# Altium project BMS_AFE.PrjPcb (part 1 of 3)
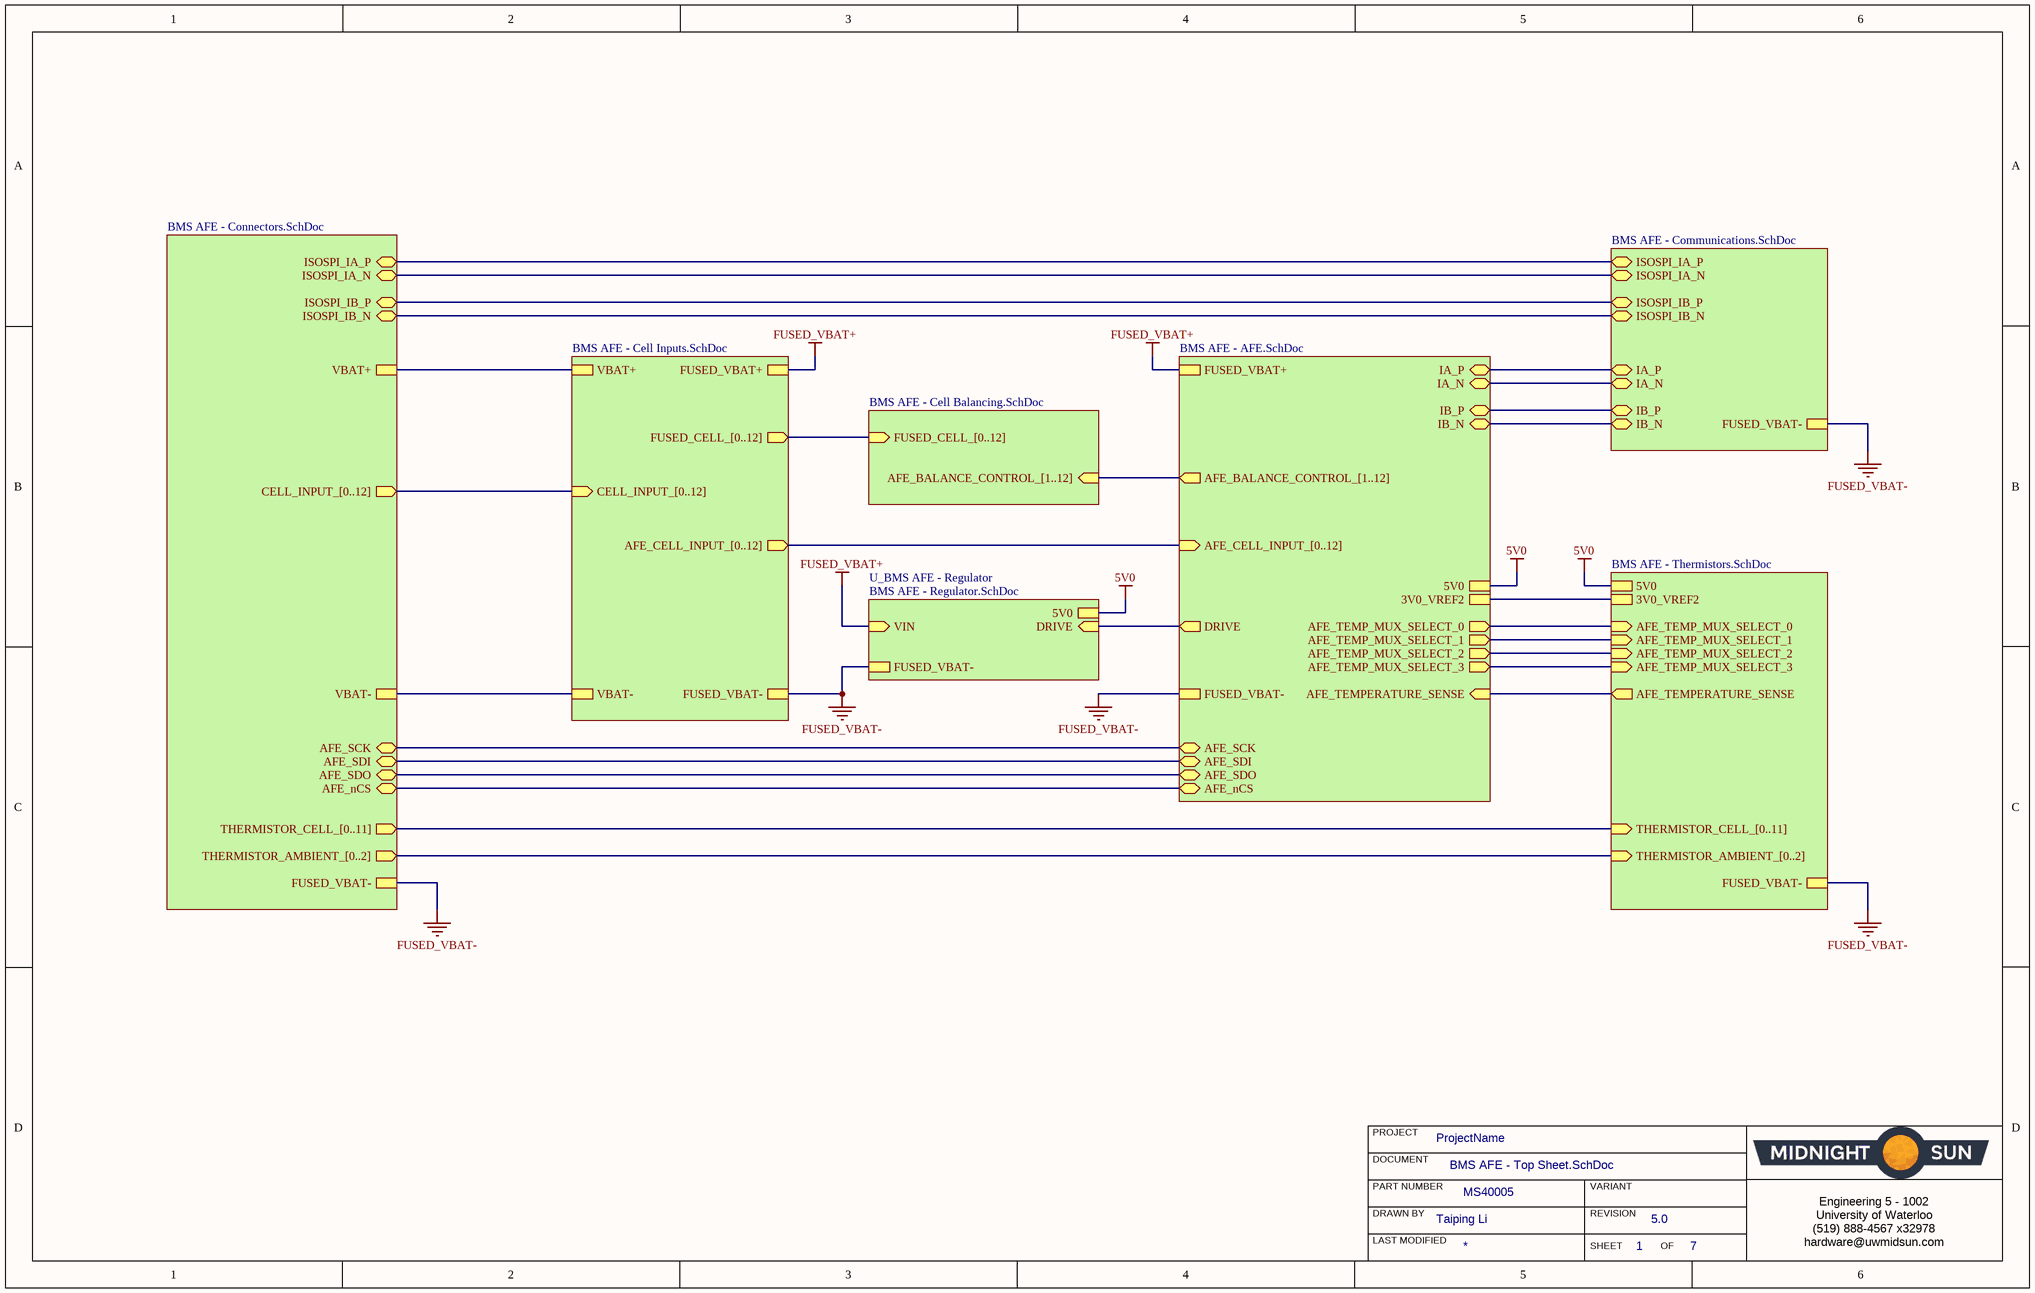
[diagram p0: BMS AFE - Top Sheet.SchDoc]
ProjectRevision: 5.0; ProjectAuthor: Taiping Li; MSPartNumber: MS40005
8 sheets, 185 parts. Net scope: strictly hierarchical (ports join the sheet entries above them; power ports are local).
Board file: AFE.PcbDoc
Sheets:
  BMS AFE - Top Sheet.SchDoc
    BMS AFE - AFE = BMS AFE - AFE.SchDoc
    BMS AFE - Cell Balancing = BMS AFE - Cell Balancing.SchDoc
    BMS AFE - Cell Inputs = BMS AFE - Cell Inputs.SchDoc
    BMS AFE - Communications = BMS AFE - Communications.SchDoc
    BMS AFE - Thermistors = BMS AFE - Thermistors.SchDoc
    BMS AFE - Connectors = BMS AFE - Connectors.SchDoc
    U_BMS AFE - Regulator = BMS AFE - Regulator.SchDoc

## Sheet BMS AFE - Top Sheet.SchDoc: Title
size B; Organization: Midnight Sun Solar Rayce Car Team; Address1: University of Waterloo; Address2: 200 University Ave W; Address3: Waterloo, ON, Canada; Address4: N2L 3E9; DocumentNumber: 1; SheetNumber: 1; SheetTotal: 7; Website: www.uwmidsun.com; ProjectName: ProjectName

### Sub-sheets
BMS AFE - AFE = BMS AFE - AFE.SchDoc: AFE_BALANCE_CONTROL_[1..12] (out), AFE_TEMP_MUX_SELECT_0 (out), AFE_TEMP_MUX_SELECT_3 (out), AFE_nCS (bidir), AFE_SCK (bidir), AFE_TEMP_MUX_SELECT_2 (out), 5V0, FUSED_VBAT-, 3V0_VREF2, AFE_CELL_INPUT_[0..12] (in), AFE_TEMPERATURE_SENSE (in), AFE_TEMP_MUX_SELECT_1 (out), FUSED_VBAT+, AFE_SDI (bidir), AFE_SDO (bidir), IA_N (bidir), IA_P (bidir), IB_N (bidir), IB_P (bidir), DRIVE (out)
BMS AFE - Cell Balancing = BMS AFE - Cell Balancing.SchDoc: FUSED_CELL_[0..12] (in), AFE_BALANCE_CONTROL_[1..12] (in)
BMS AFE - Cell Inputs = BMS AFE - Cell Inputs.SchDoc: VBAT+, FUSED_VBAT+, CELL_INPUT_[0..12] (in), AFE_CELL_INPUT_[0..12] (out), FUSED_VBAT-, FUSED_CELL_[0..12] (out), VBAT-
BMS AFE - Communications = BMS AFE - Communications.SchDoc: IB_P (bidir), IB_N (bidir), ISOSPI_IA_P (bidir), ISOSPI_IA_N (bidir), IA_P (bidir), ISOSPI_IB_P (bidir), IA_N (bidir), ISOSPI_IB_N (bidir), FUSED_VBAT-
BMS AFE - Connectors = BMS AFE - Connectors.SchDoc: ISOSPI_IB_N (bidir), ISOSPI_IB_P (bidir), ISOSPI_IA_N (bidir), ISOSPI_IA_P (bidir), VBAT+, VBAT-, AFE_nCS (bidir), AFE_SCK (bidir), CELL_INPUT_[0..12] (out), THERMISTOR_CELL_[0..11] (out), AFE_SDI (bidir), AFE_SDO (bidir), FUSED_VBAT-, THERMISTOR_AMBIENT_[0..2] (out)
BMS AFE - Thermistors = BMS AFE - Thermistors.SchDoc: AFE_TEMPERATURE_SENSE (out), THERMISTOR_AMBIENT_[0..2] (in), 5V0, 3V0_VREF2, AFE_TEMP_MUX_SELECT_3 (in), AFE_TEMP_MUX_SELECT_2 (in), AFE_TEMP_MUX_SELECT_1 (in), AFE_TEMP_MUX_SELECT_0 (in), THERMISTOR_CELL_[0..11] (in), FUSED_VBAT-
U_BMS AFE - Regulator = BMS AFE - Regulator.SchDoc: DRIVE (in), VIN (in), 5V0, FUSED_VBAT-

### Nets
3V0_VREF2: sheet BMS AFE - AFE/3V0_VREF2, sheet BMS AFE - Thermistors/3V0_VREF2
5V0: sheet BMS AFE - AFE/5V0, sheet BMS AFE - Thermistors/5V0, sheet U_BMS AFE - Regulator/5V0
FUSED_VBAT+: sheet BMS AFE - AFE/FUSED_VBAT+, sheet BMS AFE - Cell Inputs/FUSED_VBAT+, sheet U_BMS AFE - Regulator/VIN
FUSED_VBAT-: sheet BMS AFE - AFE/FUSED_VBAT-, sheet BMS AFE - Cell Inputs/FUSED_VBAT-, sheet BMS AFE - Communications/FUSED_VBAT-, sheet BMS AFE - Thermistors/FUSED_VBAT-, sheet BMS AFE - Connectors/FUSED_VBAT-, sheet U_BMS AFE - Regulator/FUSED_VBAT-
AFE_TEMP_MUX_SELECT_0: sheet BMS AFE - AFE/AFE_TEMP_MUX_SELECT_0, sheet BMS AFE - Thermistors/AFE_TEMP_MUX_SELECT_0
AFE_TEMP_MUX_SELECT_1: sheet BMS AFE - AFE/AFE_TEMP_MUX_SELECT_1, sheet BMS AFE - Thermistors/AFE_TEMP_MUX_SELECT_1
AFE_TEMP_MUX_SELECT_2: sheet BMS AFE - AFE/AFE_TEMP_MUX_SELECT_2, sheet BMS AFE - Thermistors/AFE_TEMP_MUX_SELECT_2
AFE_TEMP_MUX_SELECT_3: sheet BMS AFE - AFE/AFE_TEMP_MUX_SELECT_3, sheet BMS AFE - Thermistors/AFE_TEMP_MUX_SELECT_3
IA_N: sheet BMS AFE - AFE/IA_N, sheet BMS AFE - Communications/IA_N
IA_P: sheet BMS AFE - AFE/IA_P, sheet BMS AFE - Communications/IA_P
IB_N: sheet BMS AFE - AFE/IB_N, sheet BMS AFE - Communications/IB_N
IB_P: sheet BMS AFE - AFE/IB_P, sheet BMS AFE - Communications/IB_P
ISOSPI_IA_N: sheet BMS AFE - Communications/ISOSPI_IA_N, sheet BMS AFE - Connectors/ISOSPI_IA_N
ISOSPI_IA_P: sheet BMS AFE - Communications/ISOSPI_IA_P, sheet BMS AFE - Connectors/ISOSPI_IA_P
ISOSPI_IB_N: sheet BMS AFE - Communications/ISOSPI_IB_N, sheet BMS AFE - Connectors/ISOSPI_IB_N
ISOSPI_IB_P: sheet BMS AFE - Communications/ISOSPI_IB_P, sheet BMS AFE - Connectors/ISOSPI_IB_P
NetC42_1: sheet BMS AFE - AFE/AFE_TEMPERATURE_SENSE, sheet BMS AFE - Thermistors/AFE_TEMPERATURE_SENSE
NetF1_1: sheet BMS AFE - Cell Inputs/VBAT-, sheet BMS AFE - Connectors/VBAT-
NetF2_1: sheet BMS AFE - Cell Inputs/VBAT+, sheet BMS AFE - Connectors/VBAT+
NetP7_1: sheet BMS AFE - AFE/AFE_SCK, sheet BMS AFE - Connectors/AFE_SCK
NetP7_2: sheet BMS AFE - AFE/AFE_SDI, sheet BMS AFE - Connectors/AFE_SDI
NetP7_3: sheet BMS AFE - AFE/AFE_SDO, sheet BMS AFE - Connectors/AFE_SDO
NetP7_4: sheet BMS AFE - AFE/AFE_nCS, sheet BMS AFE - Connectors/AFE_nCS
NetR71_1: sheet BMS AFE - AFE/DRIVE, sheet U_BMS AFE - Regulator/DRIVE

### Buses and harness runs
bus sheet BMS AFE - AFE/AFE_BALANCE_CONTROL_[1..12] = sheet BMS AFE - Cell Balancing/AFE_BALANCE_CONTROL_[1..12]
bus sheet BMS AFE - AFE/AFE_CELL_INPUT_[0..12] = sheet BMS AFE - Cell Inputs/AFE_CELL_INPUT_[0..12]
bus sheet BMS AFE - Cell Balancing/FUSED_CELL_[0..12] = sheet BMS AFE - Cell Inputs/FUSED_CELL_[0..12]
bus sheet BMS AFE - Cell Inputs/CELL_INPUT_[0..12] = sheet BMS AFE - Connectors/CELL_INPUT_[0..12]
bus sheet BMS AFE - Connectors/THERMISTOR_AMBIENT_[0..2] = sheet BMS AFE - Thermistors/THERMISTOR_AMBIENT_[0..2]
bus sheet BMS AFE - Connectors/THERMISTOR_CELL_[0..11] = sheet BMS AFE - Thermistors/THERMISTOR_CELL_[0..11]

### Notes on the sheet
- PROJECT
- DOCUMENT
- DRAWN BY
- LAST MODIFIED
- PART NUMBER
- REVISION
- SHEET
- VARIANT
- OF
- Engineering 5 - 1002
  University of Waterloo
  (519) 888-4567 x32978
  hardware@uwmidsun.com

## Sheet BMS AFE - AFE.SchDoc: Title
size B; Organization: Midnight Sun Solar Rayce Car Team; Address1: University of Waterloo; Address2: 200 University Ave W; Address3: Waterloo, ON, Canada; Address4: N2L 3E9; DocumentNumber: 5; SheetNumber: 5; SheetTotal: 7; Website: www.uwmidsun.com; ProjectName: ProjectName
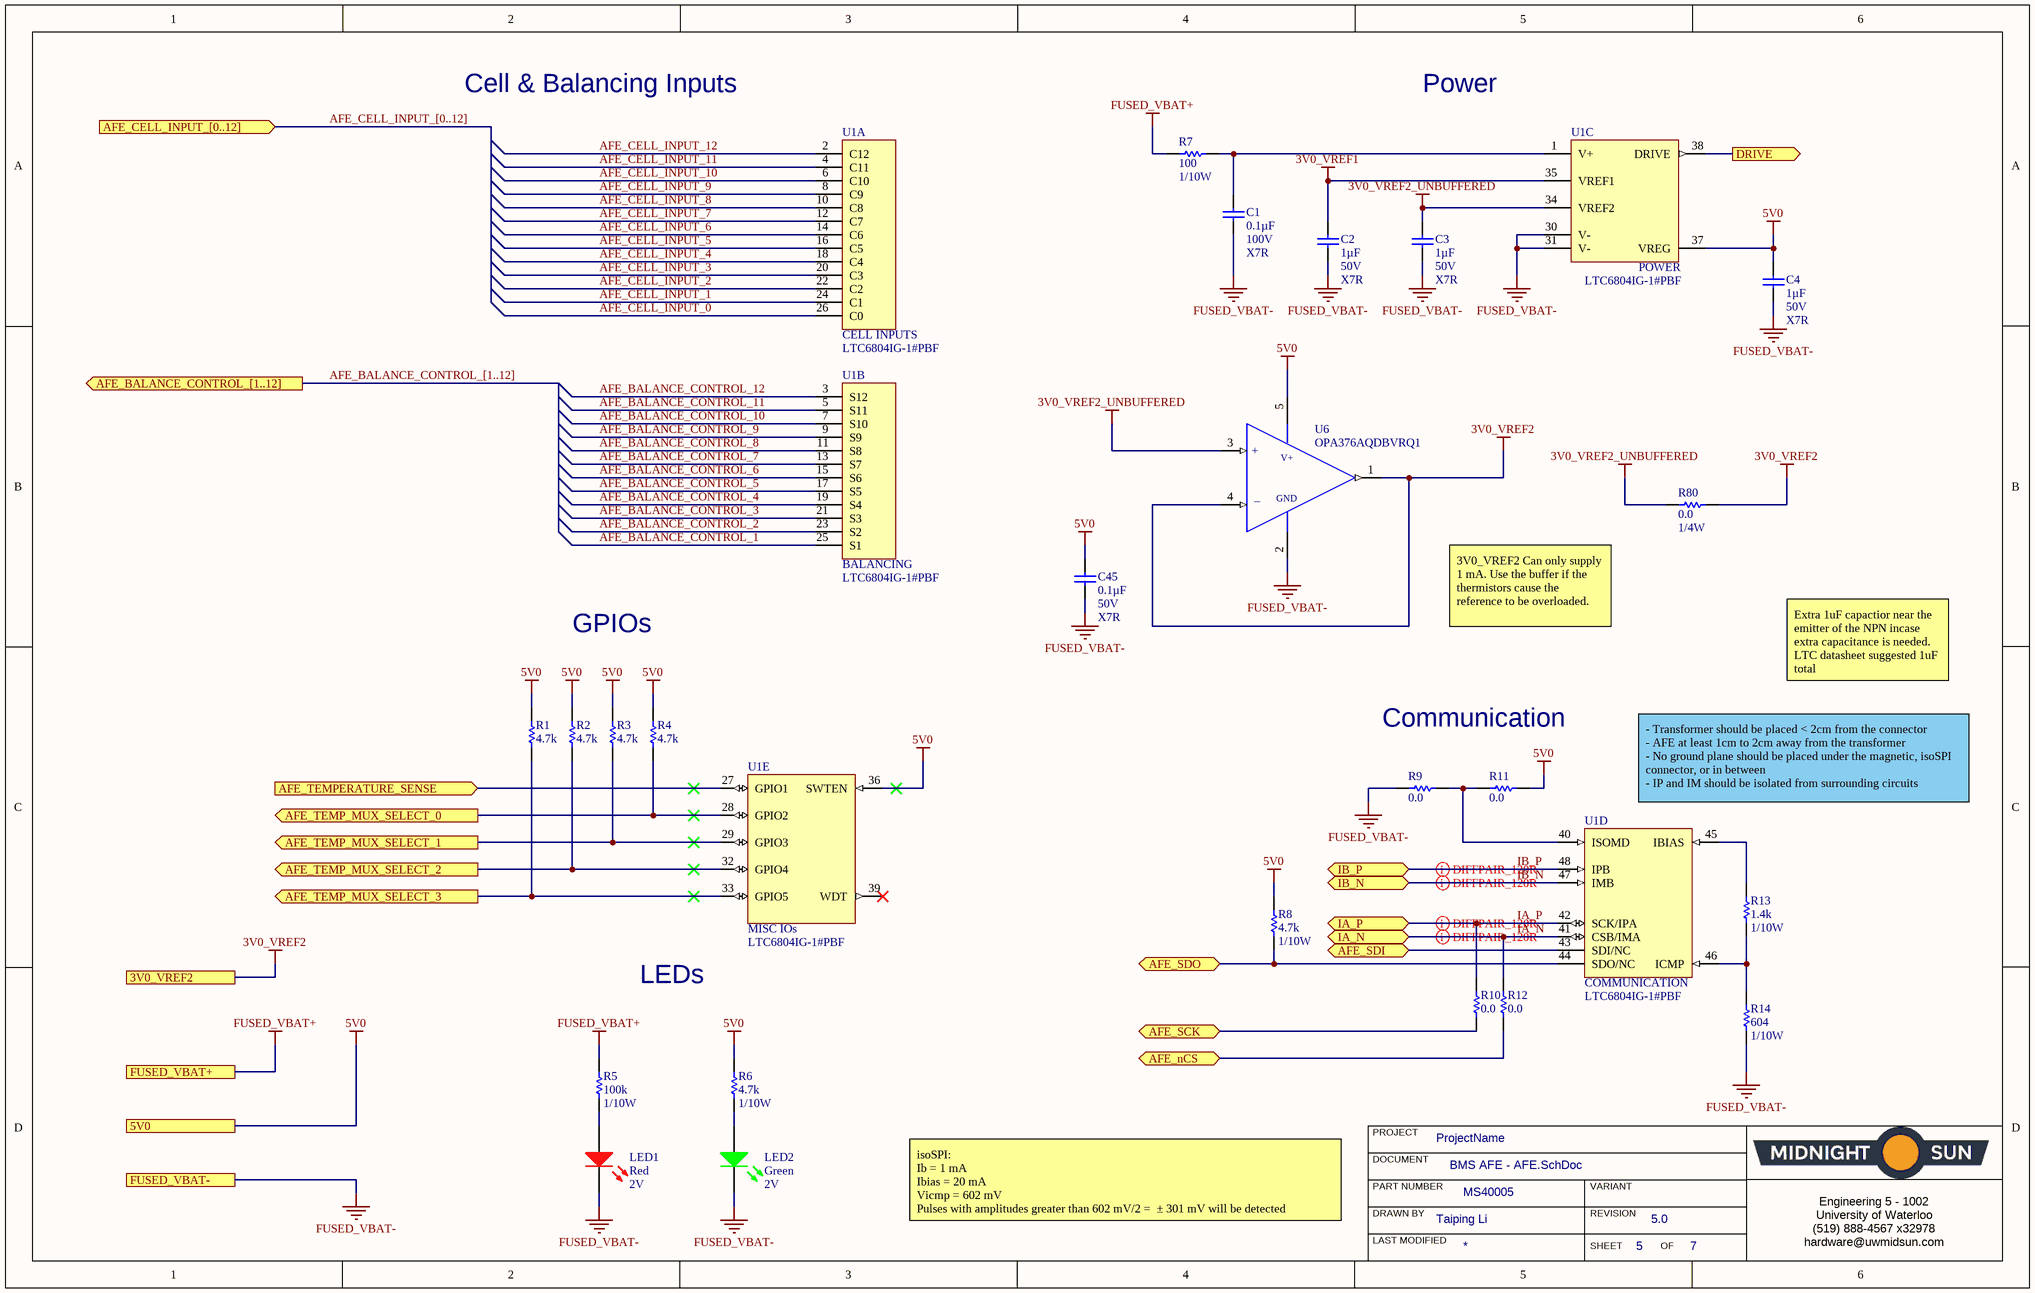
[diagram p1: BMS AFE - AFE.SchDoc]

### Parts
C1  Capacitance: 0.1µF  Voltage: 100V  Temperature Coefficient: X7R  [CAP, 0805]  (hidden comment: CAP CER 0.1UF 100V 10% X7R 0805)
C2  Capacitance: 1µF  Voltage: 50V  Temperature Coefficient: X7R  [CAP, 0603]  (hidden comment: CAP CER 1UF 50V 10% X7R 0603)
C3  Capacitance: 1µF  Voltage: 50V  Temperature Coefficient: X7R  [CAP, 0603]  (hidden comment: CAP CER 1UF 50V 10% X7R 0603)
C4  Capacitance: 1µF  Voltage: 50V  Temperature Coefficient: X7R  [CAP, 0603]  (hidden comment: CAP CER 1UF 50V 10% X7R 0603)
C45  Capacitance: 0.1µF  Voltage: 50V  Temperature Coefficient: X7R  [CAP, 0603]  (hidden comment: CAP CER 0.1UF 50V 10% X7R 0603)
LED1  Color: Red  Voltage - Forward (Vf) (Typ): 2V  [LED_0603]  (hidden comment: LED RED CLEAR 2V 0603)
LED2  Color: Green  Voltage - Forward (Vf) (Typ): 2V  [LED_0603]  (hidden comment: LED GREEN CLEAR 2V 0603)
R1  Resistance (Ohms): 4.7k  [RES, 0603]  (hidden comment: RES 4.7K OHM 1% 1/10W 0603)
R2  Resistance (Ohms): 4.7k  [RES, 0603]  (hidden comment: RES 4.7K OHM 1% 1/10W 0603)
R3  Resistance (Ohms): 4.7k  [RES, 0603]  (hidden comment: RES 4.7K OHM 1% 1/10W 0603)
R4  Resistance (Ohms): 4.7k  [RES, 0603]  (hidden comment: RES 4.7K OHM 1% 1/10W 0603)
R5  Resistance: 100k  Power: 1/10W  [RES, 0603]  (hidden comment: RES 100K OHM 5% 1/8W 0603)
R6  Resistance (Ohms): 4.7k  Power (Watts): 1/10W  [RES, 0603]  (hidden comment: RES 4.7K OHM 1% 1/10W 0603)
R7  Resistance: 100  Power: 1/10W  [RES, 0603]  (hidden comment: RES 100 OHM 1% 1/10W 0603)
R8  Resistance (Ohms): 4.7k  Power (Watts): 1/10W  [RES, 0603]  (hidden comment: RES 4.7K OHM 1% 1/10W 0603)
R9  Resistance: 0.0  [RES, 0603]  (hidden comment: RES 0.0 OHM 1/4W 0603)
R10  Resistance: 0.0  [RES, 0603]  (hidden comment: RES 0.0 OHM 1/4W 0603)
R11  Resistance: 0.0  [RES, 0603]  (hidden comment: RES 0.0 OHM 1/4W 0603)
R12  Resistance: 0.0  [RES, 0603]  (hidden comment: RES 0.0 OHM 1/4W 0603)
R13  Resistance: 1.4k  Power: 1/10W  [RES, 0603]  (hidden comment: RES 1.4k OHM 1% 1/10W 0603)
R14  Resistance: 604  Power: 1/10W  [RES, 0603]  (hidden comment: RES 604 OHM 1% 1/10W 0603)
R80  Resistance: 0.0  Power (Watts): 1/4W  [RES, 0603]  (hidden comment: RES 0.0 OHM 1/4W 0603)
U1  Manufacturer Part Number 1: LTC6804IG-1#PBF  [SSOP50P780X200-48N]  (hidden comment: IC MONITOR BATT STACK 48SSOP)  (parts A,B,C,D,E of 5)
U6  Manufacturer Part Number: OPA376AQDBVRQ1  [IC OP AMP GP RR 10MHZ SOT-23-5]  (hidden comment: IC OP AMP GEN PURPOSE RR 5.5MHZ SOT-23-5)

### Ports
3V0_VREF2, 5V0, AFE_BALANCE_CONTROL_[1..12] (out), AFE_CELL_INPUT_[0..12] (in), AFE_nCS (bidir), AFE_SCK (bidir), AFE_SDI (bidir), AFE_SDO (bidir), AFE_TEMP_MUX_SELECT_0 (out), AFE_TEMP_MUX_SELECT_1 (out), AFE_TEMP_MUX_SELECT_2 (out), AFE_TEMP_MUX_SELECT_3 (out), AFE_TEMPERATURE_SENSE (in), DRIVE (out), FUSED_VBAT+, FUSED_VBAT-, IA_N (bidir), IA_P (bidir), IB_N (bidir), IB_P (bidir)

### Nets
3V0_VREF1: C2.1 U1.35(VREF1)
3V0_VREF2: R80.2 U6.1(OUTPUT) U6.4(-IN) ; port 3V0_VREF2
3V0_VREF2_UNBUFFERED: C3.1 R80.1 U1.34(VREF2) U6.3(+IN)
5V0: C4.1 C45.1 R1.2 R2.2 R3.2 R4.2 R6.1 R8.1 R11.2 U1.36(SWTEN) U1.37(VREG) U6.5(VDD) ; port 5V0
FUSED_VBAT+: R5.1 R7.1 ; port FUSED_VBAT+
FUSED_VBAT-: C1.2 C2.2 C3.2 C4.2 C45.2 LED1.2(K) LED2.2(K) R9.1 R14.2 U1.30(V-) U1.31(V-) U6.2(VSS) ; port FUSED_VBAT-
AFE_BALANCE_CONTROL_1: U1.25(S1)
AFE_BALANCE_CONTROL_2: U1.23(S2)
AFE_BALANCE_CONTROL_3: U1.21(S3)
AFE_BALANCE_CONTROL_4: U1.19(S4)
AFE_BALANCE_CONTROL_5: U1.17(S5)
AFE_BALANCE_CONTROL_6: U1.15(S6)
AFE_BALANCE_CONTROL_7: U1.13(S7)
AFE_BALANCE_CONTROL_8: U1.11(S8)
AFE_BALANCE_CONTROL_9: U1.9(S9)
AFE_BALANCE_CONTROL_10: U1.7(S10)
AFE_BALANCE_CONTROL_11: U1.5(S11)
AFE_BALANCE_CONTROL_12: U1.3(S12)
AFE_CELL_INPUT_0: U1.26(C0)
AFE_CELL_INPUT_1: U1.24(C1)
AFE_CELL_INPUT_2: U1.22(C2)
AFE_CELL_INPUT_3: U1.20(C3)
AFE_CELL_INPUT_4: U1.18(C4)
AFE_CELL_INPUT_5: U1.16(C5)
AFE_CELL_INPUT_6: U1.14(C6)
AFE_CELL_INPUT_7: U1.12(C7)
AFE_CELL_INPUT_8: U1.10(C8)
AFE_CELL_INPUT_9: U1.8(C9)
AFE_CELL_INPUT_10: U1.6(C10)
AFE_CELL_INPUT_11: U1.4(C11)
AFE_CELL_INPUT_12: U1.2(C12)
AFE_TEMP_MUX_SELECT_0: R4.1 U1.28(GPIO2) ; port AFE_TEMP_MUX_SELECT_0
AFE_TEMP_MUX_SELECT_1: R3.1 U1.29(GPIO3) ; port AFE_TEMP_MUX_SELECT_1
AFE_TEMP_MUX_SELECT_2: R2.1 U1.32(GPIO4) ; port AFE_TEMP_MUX_SELECT_2
AFE_TEMP_MUX_SELECT_3: R1.1 U1.33(GPIO5) ; port AFE_TEMP_MUX_SELECT_3
IA_N: R12.1 U1.41(CSB/IMA) ; port IA_N
IA_P: R10.1 U1.42(SCK/IPA) ; port IA_P
IB_N: U1.47(IMB) ; port IB_N
IB_P: U1.48(IPB) ; port IB_P
NetC1_1: C1.1 R7.2 U1.1(V+)
NetC42_1: U1.27(GPIO1) ; port AFE_TEMPERATURE_SENSE
NetLED1_1: LED1.1(A) R5.2
NetLED2_1: LED2.1(A) R6.2
NetP7_1: R10.2 ; port AFE_SCK
NetP7_2: U1.43(SDI/NC) ; port AFE_SDI
NetP7_3: R8.2 U1.44(SDO/NC) ; port AFE_SDO
NetP7_4: R12.2 ; port AFE_nCS
NetR9_2: R9.2 R11.1 U1.40(ISOMD)
NetR13_1: R13.1 U1.45(IBIAS)
NetR13_2: R13.2 R14.1 U1.46(ICMP)
NetR71_1: U1.38(DRIVE) ; port DRIVE

Not connected (* = marked no-connect by the designer): U1 39(WDT)*

### Buses and harness runs
bus AFE_BALANCE_CONTROL_[1..12] = port AFE_BALANCE_CONTROL_[1..12]
bus AFE_CELL_INPUT_[0..12] = port AFE_CELL_INPUT_[0..12]

### Layout directives
differential pair: IA_N, IA_P, IB_N, IB_P

### Notes on the sheet
- Cell & Balancing Inputs
- Power
- GPIOs
- 3V0_VREF2 Can only supply  1 mA. Use the buffer if the thermistors cause the reference to be overloaded.
- Extra 1uF capactior near the emitter of the NPN incase extra capacitance is needed. LTC datasheet suggested 1uF total
- Communication
- (near U1) - Transformer should be placed < 2cm from the connector
  - AFE at least 1cm to 2cm away from the transformer
  - No ground plane should be placed under the magnetic, isoSPI connector, or in between
  - IP and IM should be isolated from surrounding circuits
- LEDs
- isoSPI:
  Ib = 1 mA
  Ibias = 20 mA
  Vicmp = 602 mV
  Pulses with amplitudes greater than 602 mV/2 =  ± 301 mV will be detected
- PROJECT
- DOCUMENT
- DRAWN BY
- LAST MODIFIED
- PART NUMBER
- REVISION
- SHEET
- VARIANT
- OF
- Engineering 5 - 1002
  University of Waterloo
  (519) 888-4567 x32978
  hardware@uwmidsun.com
- (in symbol IC MONITOR BATT STACK 48SSOP, part A) CELL INPUTS
- (in symbol IC MONITOR BATT STACK 48SSOP, part B) BALANCING
- (in symbol IC MONITOR BATT STACK 48SSOP, part C) POWER
- (in symbol IC MONITOR BATT STACK 48SSOP, part D) COMMUNICATION
- (in symbol IC MONITOR BATT STACK 48SSOP, part E) MISC IOs
- (in symbol IC OP AMP GEN PURPOSE RR 5.5MHZ SOT-23-5) +; V+; GND; _

### Library data of the parts
C1 = CAP CER 0.1UF 100V 10% X7R 0805: 0.1µF ±10% 100V Ceramic Capacitor X7R 0805 (2012 Metric); Manufacturer 1: Murata Electronics North America; Manufacturer Part Number 1: GCM21BR72A104KA37L; Supplier 1: Digi-Key; Supplier Part Number 1: 490-4789-1-ND; Packaging: Cut Tape (CT); Part Status: Active; Operating Temperature: -55°C ~ 125°C; Ratings: AEC-Q200; Mounting Type: Surface Mount, MLCC; Package / Case: 0805 (2012 Metric); Size / Dimension: 0.079" L x 0.049" W (2.00mm x 1.25mm); Height - Seated (Max): -; Thickness (Max): 0.055" (1.40mm); Lead Spacing: -; Lead Style: -; ComponentLink1URL: http://www.murata.com/~/media/webrenewal/support/library/catalog/products/capacitor/mlcc/c03e.ashx; ComponentLink1Description: http://www.murata.com/~/media/webrenewal/support/library/catalog/products/capacitor/mlcc/c03e.ashx; Tolerance: ±10%
C2-C4 = CAP CER 1UF 50V 10% X7R 0603: 1µF ±10% 50V Ceramic Capacitor X7R 0603 (1608 Metric); Manufacturer 1: Taiyo Yuden; Manufacturer Part Number 1: UMK107AB7105KA-T; Supplier 1: Digi-Key; Supplier Part Number 1: 587-3247-1-ND; Packaging: Cut Tape (CT); Part Status: Active; Operating Temperature: -55°C ~ 125°C; Ratings: -; Mounting Type: Surface Mount, MLCC; Package / Case: 0603 (1608 Metric); Size / Dimension: 0.063" L x 0.031" W (1.60mm x 0.80mm); Height - Seated (Max): -; Thickness (Max): 0.037" (0.95mm); Lead Spacing: -; Lead Style: -; ComponentLink1URL: http://www.yuden.co.jp/productdata/catalog/en/mlcc_all_e.pdf; ComponentLink1Description: http://www.yuden.co.jp/productdata/catalog/en/mlcc_all_e.pdf; Tolerance: ±10%
C45 = CAP CER 0.1UF 50V 10% X7R 0603: 0.10µF ±10% 50V Ceramic Capacitor X7R 0603 (1608 Metric); Manufacturer 1: AVX Corporation; Manufacturer Part Number 1: 06035C104KAT2A; Supplier 1: Digi-Key; Supplier Part Number 1: 478-5052-1-ND; Packaging: Cut Tape (CT); Part Status: Active; Operating Temperature: -55°C ~ 125°C; Ratings: -; Mounting Type: Surface Mount, MLCC; Package / Case: 0603 (1608 Metric); Size / Dimension: 0.063" L x 0.032" W (1.60mm x 0.81mm); Height - Seated (Max): -; Thickness (Max): 0.035" (0.90mm); Lead Spacing: -; Lead Style: -; ComponentLink1URL: http://datasheets.avx.com/X7RDielectric.pdf; ComponentLink1Description: http://datasheets.avx.com/X7RDielectric.pdf; Tolerance: ±10%
LED1 = LED RED CLEAR 2V 0603: Red 631nm LED Indication - Discrete 2V 0603 (1608 Metric); Manufacturer: Wurth Electronics Inc.; Manufacturer Part Number: 150060RS75000; Lens Color: Colorless; Millicandela Rating: 250mcd; Lens Style/Size: Rectangle with Flat Top, 1.10mm x 0.70mm; Current - Test: 20mA; Viewing Angle: 140°; Wavelength - Dominant: 625nm; Wavelength - Peak: 630nm; Supplier 1: Digi-Key; RoHS: RoHS Compliant; Category: Optoelectronics; Stock 1: 35521; Pricing 1: 1=0.21, 100=0.1617, 500=0.13964 (CAD); Packaging: Cut Tape (CT); Part Status: Active; Lens Transparency: Clear; Mounting Type: Surface Mount; Features: -; Package / Case: 0603 (1608 Metric); Supplier Device Package: 0603; Size / Dimension: 1.60mm L x 0.80mm W; Height (Max): 0.80mm; ComponentLink1URL: http://katalog.we-online.de/led/datasheet/150060RS75000.pdf; ComponentLink1Description: http://katalog.we-online.de/led/datasheet/150060RS75000.pdf; Supplier Part Number 1: 732-4978-1-ND
LED2 = LED GREEN CLEAR 2V 0603: Green 572nm LED Indication - Discrete 2V 0603 (1608 Metric); Manufacturer: Wurth Electronics Inc.; Manufacturer Part Number: 150060VS75000; Lens Color: Colorless; Millicandela Rating: 40mcd; Lens Style/Size: Rectangle with Flat Top, 1.10mm x 0.70mm; Current - Test: 20mA; Viewing Angle: 140°; Wavelength - Dominant: 570nm; Supplier 1: Digi-Key; RoHS: RoHS Compliant; Category: Optoelectronics; Stock 1: 9408; Pricing 1: 1=0.21, 100=0.1617, 500=0.13964 (CAD); Packaging: Cut Tape (CT); Part Status: Active; Lens Transparency: Clear; Mounting Type: Surface Mount; Wavelength - Peak: 572nm; Features: -; Package / Case: 0603 (1608 Metric); Supplier Device Package: 0603; Size / Dimension: 1.60mm L x 0.80mm W; Height (Max): 0.80mm; ComponentLink1URL: http://katalog.we-online.de/led/datasheet/150060VS75000.pdf; ComponentLink1Description: http://katalog.we-online.de/led/datasheet/150060VS75000.pdf; Supplier Part Number 1: 732-4980-1-ND
R1-R4 R8 = RES 4.7K OHM 1% 1/10W 0603: 4.7k Ohm ±1% 0.1W, 1/10W Chip Resistor 0603 (1608 Metric) Moisture Resistant Thick Film; Manufacturer 1: Yageo; Manufacturer Part Number 1: RC0603FR-074K7L; Description 1: RES SMD 4.7K OHM 1% 1/10W 0603; Temperature Coefficient: ±100ppm/°C; Supplier 1: Digi-Key; Supplier Part Number 1: 311-4.70KHRCT-ND; RoHS: RoHS Compliant; Category: Resistors; Stock 1: 3487566; Pricing 1: 1=0.16, 10=0.022, 100=0.0089, 1000=0.00402, 2500=0.00349 (CAD); Packaging: Cut Tape (CT); Part Status: Active; Composition: Thick Film; Features: Moisture Resistant; Operating Temperature: -55°C ~ 155°C; Package / Case: 0603 (1608 Metric); Supplier Device Package: 0603; Size / Dimension: 0.063" L x 0.031" W (1.60mm x 0.80mm); Height - Seated (Max): 0.022" (0.55mm); Failure Rate: -; ComponentLink1URL: http://www.yageo.com/documents/recent/PYu-RC_Group_51_RoHS_L_7.pdf; ComponentLink1Description: http://www.yageo.com/documents/recent/PYu-RC_Group_51_RoHS_L_7.pdf; Tolerance: ±1%
  R1-R4: Power (Watts): 1/10W
R5 = RES 100K OHM 5% 1/8W 0603: RES SMD 100K OHM 5% 1/10W 0603; Manufacturer 1: Yageo; Manufacturer Part Number 1: RC0603JR-07100KL; Temperature Coefficient: ±100ppm/°C; Supplier 1: Digi-Key; Supplier Part Number 1: 311-100KGRCT-ND; Packaging: Cut Tape (CT); Part Status: Active; Composition: Thick Film; Operating Temperature: -55°C ~ 155°C; Package / Case: 0603 (1608 Metric); Supplier Device Package: 0603; Size / Dimension: 0.063" L x 0.031" W (1.60mm x 0.80mm); Height - Seated (Max): 0.022" (0.55mm); Failure Rate: -; ComponentLink1URL: http://www.yageo.com/documents/recent/PYu-RC_Group_51_RoHS_L_7.pdf; ComponentLink1Description: http://www.yageo.com/documents/recent/PYu-RC_Group_51_RoHS_L_7.pdf; Tolerance: ±5%
R6 = RES 4.7K OHM 1% 1/10W 0603: 4.7k Ohm ±1% 0.1W, 1/10W Chip Resistor 0603 (1608 Metric) Moisture Resistant Thick Film; Manufacturer 1: Yageo; Manufacturer Part Number 1: RC0603FR-074K7L; Temperature Coefficient: ±100ppm/°C; Description 1: RES SMD 4.7K OHM 1% 1/10W 0603; Supplier 1: Digi-Key; Supplier Part Number 1: 311-4.70KHRCT-ND; Packaging: Cut Tape (CT); Part Status: Active; Composition: Thick Film; Operating Temperature: -55°C ~ 155°C; Package / Case: 0603 (1608 Metric); Supplier Device Package: 0603; Size / Dimension: 0.063" L x 0.031" W (1.60mm x 0.80mm); Height - Seated (Max): 0.022" (0.55mm); Failure Rate: -; ComponentLink1URL: http://www.yageo.com/documents/recent/PYu-RC_Group_51_RoHS_L_7.pdf; ComponentLink1Description: http://www.yageo.com/documents/recent/PYu-RC_Group_51_RoHS_L_7.pdf; Tolerance: ±1%; RoHS: RoHS Compliant; Category: Resistors; Stock 1: 3487566; Pricing 1: 1=0.16, 10=0.022, 100=0.0089, 1000=0.00402, 2500=0.00349 (CAD); Features: Moisture Resistant
R7 = RES 100 OHM 1% 1/10W 0603: 100 Ohm ±1% 0.1W, 1/10W Chip Resistor 0603 (1608 Metric) Moisture Resistant Thick Film; Manufacturer 1: Yageo; Manufacturer Part Number 1: RC0603FR-07100RL; Temperature Coefficient: ±100ppm/°C; Supplier 1: Digi-Key; Supplier Part Number 1: 311-100HRCT-ND; Packaging: Cut Tape (CT); Part Status: Active; Composition: Thick Film; Operating Temperature: -55°C ~ 155°C; Package / Case: 0603 (1608 Metric); Supplier Device Package: 0603; Size / Dimension: 0.063" L x 0.031" W (1.60mm x 0.80mm); Height - Seated (Max): 0.022" (0.55mm); Failure Rate: -; ComponentLink1URL: http://www.yageo.com/documents/recent/PYu-RC_Group_51_RoHS_L_7.pdf; ComponentLink1Description: http://www.yageo.com/documents/recent/PYu-RC_Group_51_RoHS_L_7.pdf; Tolerance: ±1%
R9-R12 R80 = RES 0.0 OHM 1/4W 0603: RES SMD 0.0 OHM JUMPER 1/4W 0603; Manufacturer 1: Vishay Dale; Manufacturer Part Number 1: CRCW06030000Z0EAHP; Supplier 1: Digi-Key; Supplier Part Number 1: 541-0.0SBCT-ND; Packaging: Cut Tape (CT); Part Status: Active; Composition: Thick Film; Operating Temperature: -55°C ~ 155°C; Package / Case: 0603 (1608 Metric); Supplier Device Package: 0603; Size / Dimension: 0.063" L x 0.033" W (1.60mm x 0.85mm); Height - Seated (Max): 0.022" (0.55mm); Failure Rate: -; ComponentLink1URL: http://www.vishay.com/docs/20043/crcwhpe3.pdf; ComponentLink1Description: http://www.vishay.com/docs/20043/crcwhpe3.pdf
  R9-R12: Power (Watts): 1/4W
R13 = RES 1.4k OHM 1% 1/10W 0603: RES SMD 1.4K OHM 1% 1/10W 0603; Manufacturer 1: Yageo; Manufacturer Part Number 1: RC0603FR-071K4L; Temperature Coefficient: ±100ppm/°C; Supplier 1: Digi-Key; Supplier Part Number 1: 311-1.40KHRCT-ND; Packaging: Cut Tape (CT); Part Status: Active; Composition: Thick Film; Operating Temperature: -55°C ~ 155°C; Package / Case: 0603 (1608 Metric); Supplier Device Package: 0603; Size / Dimension: 0.063" L x 0.031" W (1.60mm x 0.80mm); Height - Seated (Max): 0.022" (0.55mm); Failure Rate: -; ComponentLink1URL: http://www.yageo.com/documents/recent/PYu-RC_Group_51_RoHS_L_7.pdf; ComponentLink1Description: http://www.yageo.com/documents/recent/PYu-RC_Group_51_RoHS_L_7.pdf; Tolerance: ±1%
R14 = RES 604 OHM 1% 1/10W 0603: RES SMD 604 OHM 1% 1/10W 0603; Manufacturer 1: Yageo; Manufacturer Part Number 1: RC0603FR-07604RL; Temperature Coefficient: ±100ppm/°C; Supplier 1: Digi-Key; Supplier Part Number 1: 311-604HRCT-ND; Packaging: Cut Tape (CT); Part Status: Active; Composition: Thick Film; Operating Temperature: -55°C ~ 155°C; Package / Case: 0603 (1608 Metric); Supplier Device Package: 0603; Size / Dimension: 0.063" L x 0.031" W (1.60mm x 0.80mm); Height - Seated (Max): 0.022" (0.55mm); Failure Rate: -; ComponentLink1URL: http://www.yageo.com/documents/recent/PYu-RC_Group_51_RoHS_L_7.pdf; ComponentLink1Description: http://www.yageo.com/documents/recent/PYu-RC_Group_51_RoHS_L_7.pdf; Tolerance: ±1%
U1 = IC MONITOR BATT STACK 48SSOP: Battery Battery Monitor IC Multi-Chemistry 48-SSOP; Manufacturer 1: Linear Technology; Number of Cells: 1 ~ 12; Fault Protection: Over/Under Voltage; Interface: I²C, SPI; Supplier 1: Digi-Key; Supplier Part Number 1: LTC6804IG-1#PBF-ND; Packaging: Tube; Part Status: Active; Function: Battery Monitor; Battery Chemistry: Multi-Chemistry; Operating Temperature: -40°C ~ 85°C (TA); Package / Case: 48-FSOP (0.209", 5.30mm Width); Supplier Device Package: 48-SSOP; ComponentLink1URL: http://www.linear.com/docs/43171; ComponentLink1Description: http://www.linear.com/docs/43171
U6 = IC OP AMP GEN PURPOSE RR 5.5MHZ SOT-23-5: General Purpose Amplifier 1 Circuit Rail-to-Rail SOT-23-5; Manufacturer: Texas Instruments; Max Supply Voltage: 5.5V; Min Supply Voltage: 2.2V; Output Current: 30mA; Nominal Supply Current: 950uA; Voltage Gain: 134dB; Common Mode Rejection Ratio: 76dB; Number of Channels: 1; Slew Rate: 2V/µs; Max I/O Voltage: 25uV; Input Bias Current: 10pA; Operating Supply Current: 760uA; Output Current per Channel: 50mA; Power Supply Rejection Ratio (PSRR): 106.02dB; Supplier 1: Digi-Key; Stock 1: 26635; Pricing 1: 1 = 2.14000, 10 = 1.92200, 100 = 1.54450, 500 = 1.26896, 1000 = 1.05142 (USD); RoHS: Yes; Case/Package: SOT-23-5; Number of Pins: 5; Min Operating Temperature: -40°C; Max Operating Temperature: 125°C; Unity Gain Bandwidth Product: 5.5MHz; Packaging: Tape and Reel; Package Quantity: 3000; Number of Circuits: 1; Gain Bandwidth Product: 5.5MHz; Input Offset Voltage (Vos): 25uV; Number of Elements: 1; Radiation Hardening: No; Lead Free: Lead Free; ComponentLink1URL: http://www.ti.com/lit/ds/sbos549/sbos549.pdf?src-supplier=Avnet; ComponentLink1Description: http://www.ti.com/lit/ds/sbos549/sbos549.pdf?src-supplier=Avnet; Supplier Part Number 1: 296-36701-1-ND

## Sheet BMS AFE - Cell Balancing.SchDoc: Title
size B; Organization: Midnight Sun Solar Rayce Car Team; Address1: University of Waterloo; Address2: 200 University Ave W; Address3: Waterloo, ON, Canada; Address4: N2L 3E9; DocumentNumber: 4; SheetNumber: 4; SheetTotal: 7; Website: www.uwmidsun.com; ProjectName: ProjectName
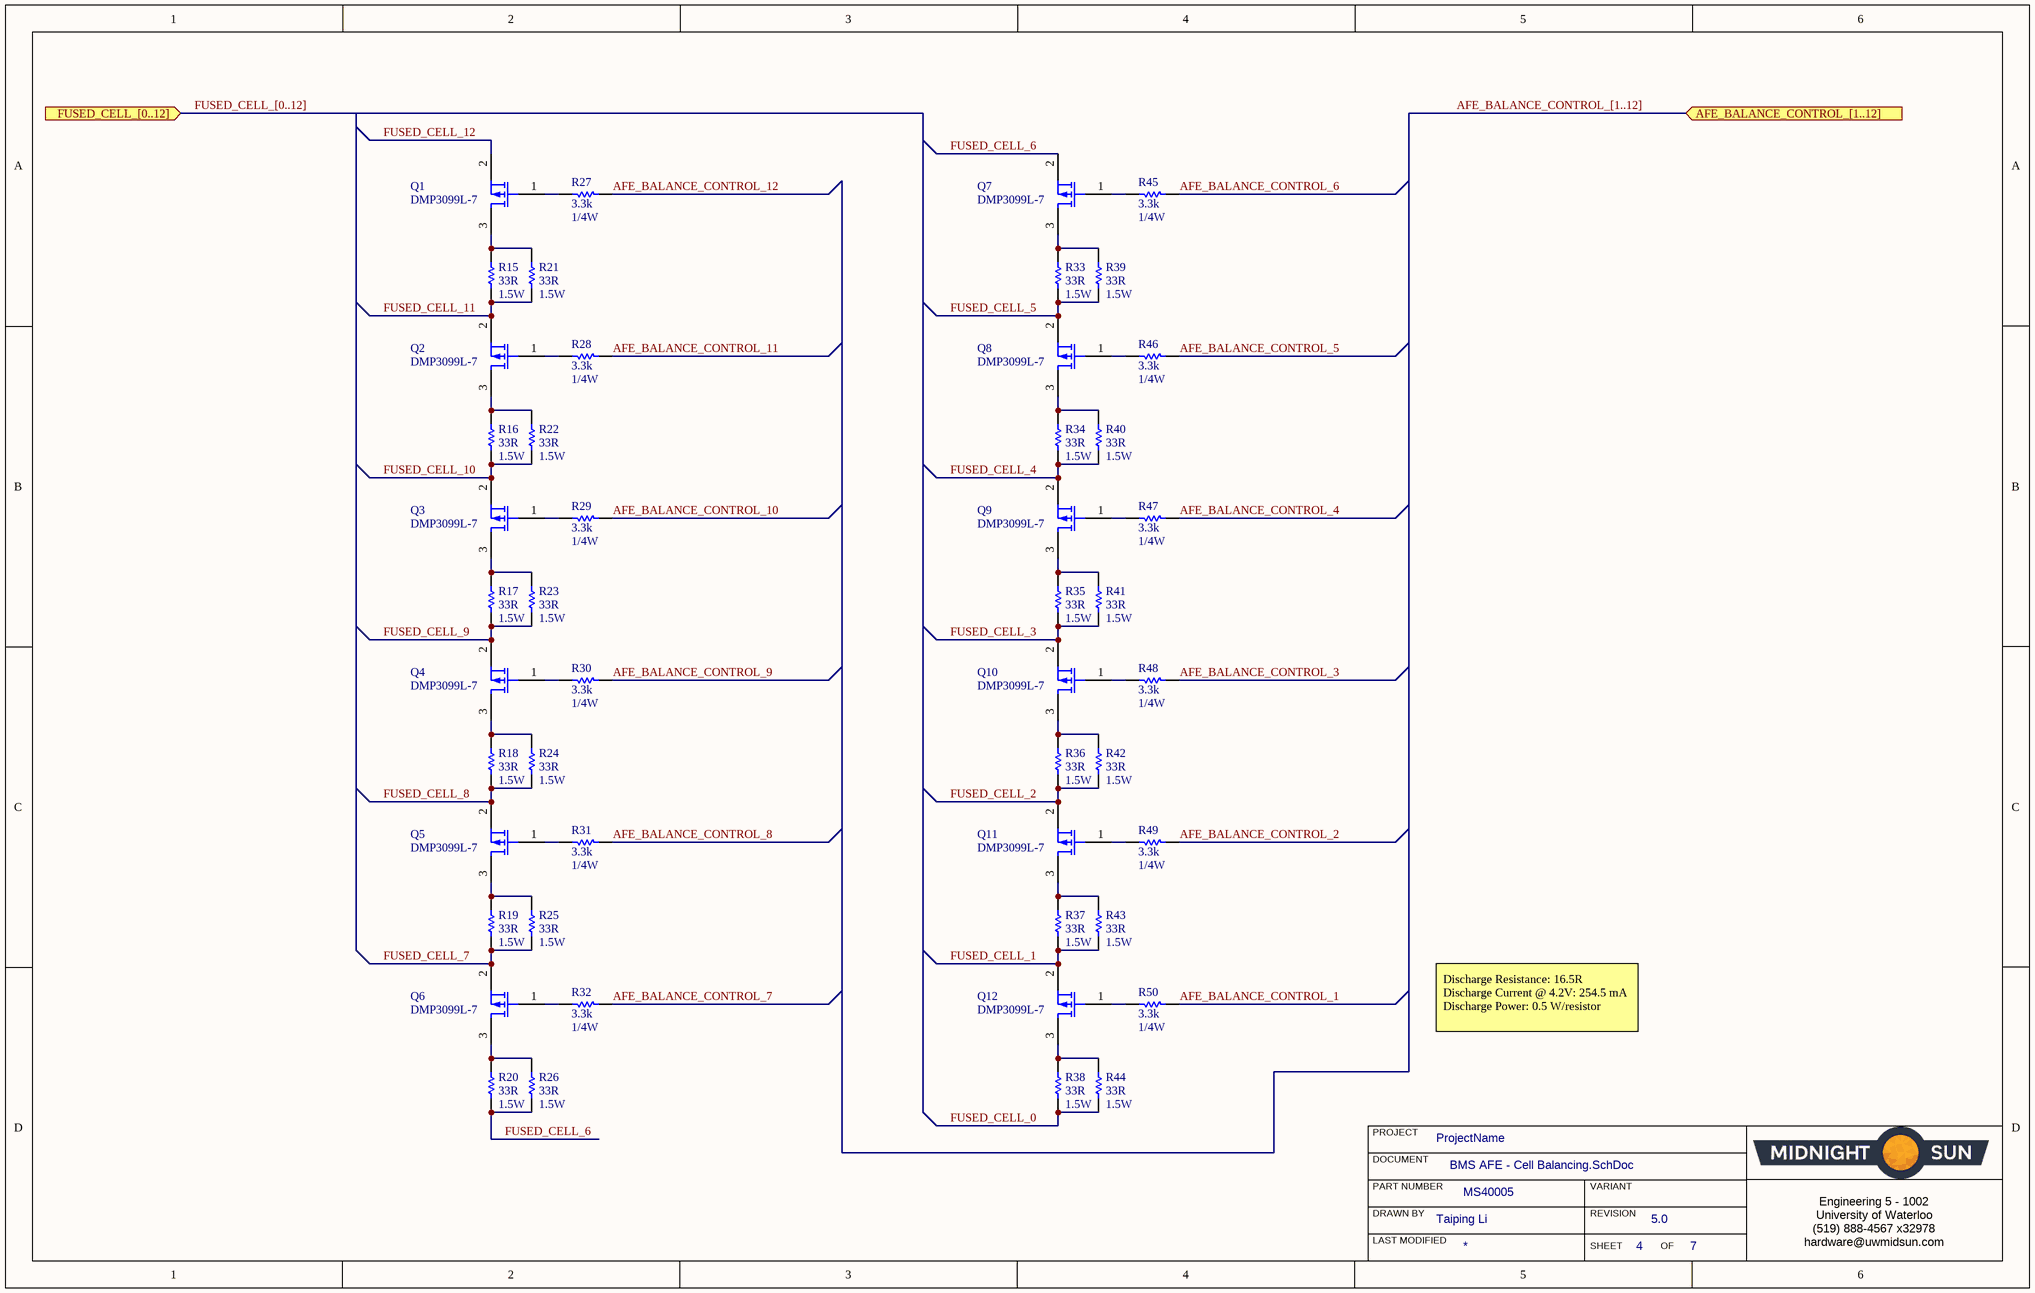
[diagram p2: BMS AFE - Cell Balancing.SchDoc]

### Parts
Q1  Manufacturer Part Number: DMP3099L-7  [MOSFET P-CH 30V 3.8A SOT-23]  (hidden comment: MOSFET P-CH 30V 3.8A SOT-23)
Q2  Manufacturer Part Number: DMP3099L-7  [MOSFET P-CH 30V 3.8A SOT-23]  (hidden comment: MOSFET P-CH 30V 3.8A SOT-23)
Q3  Manufacturer Part Number: DMP3099L-7  [MOSFET P-CH 30V 3.8A SOT-23]  (hidden comment: MOSFET P-CH 30V 3.8A SOT-23)
Q4  Manufacturer Part Number: DMP3099L-7  [MOSFET P-CH 30V 3.8A SOT-23]  (hidden comment: MOSFET P-CH 30V 3.8A SOT-23)
Q5  Manufacturer Part Number: DMP3099L-7  [MOSFET P-CH 30V 3.8A SOT-23]  (hidden comment: MOSFET P-CH 30V 3.8A SOT-23)
Q6  Manufacturer Part Number: DMP3099L-7  [MOSFET P-CH 30V 3.8A SOT-23]  (hidden comment: MOSFET P-CH 30V 3.8A SOT-23)
Q7  Manufacturer Part Number: DMP3099L-7  [MOSFET P-CH 30V 3.8A SOT-23]  (hidden comment: MOSFET P-CH 30V 3.8A SOT-23)
Q8  Manufacturer Part Number: DMP3099L-7  [MOSFET P-CH 30V 3.8A SOT-23]  (hidden comment: MOSFET P-CH 30V 3.8A SOT-23)
Q9  Manufacturer Part Number: DMP3099L-7  [MOSFET P-CH 30V 3.8A SOT-23]  (hidden comment: MOSFET P-CH 30V 3.8A SOT-23)
Q10  Manufacturer Part Number: DMP3099L-7  [MOSFET P-CH 30V 3.8A SOT-23]  (hidden comment: MOSFET P-CH 30V 3.8A SOT-23)
Q11  Manufacturer Part Number: DMP3099L-7  [MOSFET P-CH 30V 3.8A SOT-23]  (hidden comment: MOSFET P-CH 30V 3.8A SOT-23)
Q12  Manufacturer Part Number: DMP3099L-7  [MOSFET P-CH 30V 3.8A SOT-23]  (hidden comment: MOSFET P-CH 30V 3.8A SOT-23)
R15  value 33R  Power (Watts): 1.5W  [RES STACKPOLE RPC2512 2512]  (hidden comment: RES 33 OHM 5% 1.5W 2512)
R16  value 33R  Power (Watts): 1.5W  [RES STACKPOLE RPC2512 2512]  (hidden comment: RES 33 OHM 5% 1.5W 2512)
R17  value 33R  Power (Watts): 1.5W  [RES STACKPOLE RPC2512 2512]  (hidden comment: RES 33 OHM 5% 1.5W 2512)
R18  value 33R  Power (Watts): 1.5W  [RES STACKPOLE RPC2512 2512]  (hidden comment: RES 33 OHM 5% 1.5W 2512)
R19  value 33R  Power (Watts): 1.5W  [RES STACKPOLE RPC2512 2512]  (hidden comment: RES 33 OHM 5% 1.5W 2512)
R20  value 33R  Power (Watts): 1.5W  [RES STACKPOLE RPC2512 2512]  (hidden comment: RES 33 OHM 5% 1.5W 2512)
R21  value 33R  Power (Watts): 1.5W  [RES STACKPOLE RPC2512 2512]  (hidden comment: RES 33 OHM 5% 1.5W 2512)
R22  value 33R  Power (Watts): 1.5W  [RES STACKPOLE RPC2512 2512]  (hidden comment: RES 33 OHM 5% 1.5W 2512)
R23  value 33R  Power (Watts): 1.5W  [RES STACKPOLE RPC2512 2512]  (hidden comment: RES 33 OHM 5% 1.5W 2512)
R24  value 33R  Power (Watts): 1.5W  [RES STACKPOLE RPC2512 2512]  (hidden comment: RES 33 OHM 5% 1.5W 2512)
R25  value 33R  Power (Watts): 1.5W  [RES STACKPOLE RPC2512 2512]  (hidden comment: RES 33 OHM 5% 1.5W 2512)
R26  value 33R  Power (Watts): 1.5W  [RES STACKPOLE RPC2512 2512]  (hidden comment: RES 33 OHM 5% 1.5W 2512)
R27  Resistance: 3.3k  Power: 1/4W  [RES, 0603]  (hidden comment: RES 3.3K OHM 1% 1/4W 0603)
R28  Resistance: 3.3k  Power: 1/4W  [RES, 0603]  (hidden comment: RES 3.3K OHM 1% 1/4W 0603)
R29  Resistance: 3.3k  Power: 1/4W  [RES, 0603]  (hidden comment: RES 3.3K OHM 1% 1/4W 0603)
R30  Resistance: 3.3k  Power: 1/4W  [RES, 0603]  (hidden comment: RES 3.3K OHM 1% 1/4W 0603)
R31  Resistance: 3.3k  Power: 1/4W  [RES, 0603]  (hidden comment: RES 3.3K OHM 1% 1/4W 0603)
R32  Resistance: 3.3k  Power: 1/4W  [RES, 0603]  (hidden comment: RES 3.3K OHM 1% 1/4W 0603)
R33  value 33R  Power (Watts): 1.5W  [RES STACKPOLE RPC2512 2512]  (hidden comment: RES 33 OHM 5% 1.5W 2512)
R34  value 33R  Power (Watts): 1.5W  [RES STACKPOLE RPC2512 2512]  (hidden comment: RES 33 OHM 5% 1.5W 2512)
R35  value 33R  Power (Watts): 1.5W  [RES STACKPOLE RPC2512 2512]  (hidden comment: RES 33 OHM 5% 1.5W 2512)
R36  value 33R  Power (Watts): 1.5W  [RES STACKPOLE RPC2512 2512]  (hidden comment: RES 33 OHM 5% 1.5W 2512)
R37  value 33R  Power (Watts): 1.5W  [RES STACKPOLE RPC2512 2512]  (hidden comment: RES 33 OHM 5% 1.5W 2512)
R38  value 33R  Power (Watts): 1.5W  [RES STACKPOLE RPC2512 2512]  (hidden comment: RES 33 OHM 5% 1.5W 2512)
R39  value 33R  Power (Watts): 1.5W  [RES STACKPOLE RPC2512 2512]  (hidden comment: RES 33 OHM 5% 1.5W 2512)
R40  value 33R  Power (Watts): 1.5W  [RES STACKPOLE RPC2512 2512]  (hidden comment: RES 33 OHM 5% 1.5W 2512)
R41  value 33R  Power (Watts): 1.5W  [RES STACKPOLE RPC2512 2512]  (hidden comment: RES 33 OHM 5% 1.5W 2512)
R42  value 33R  Power (Watts): 1.5W  [RES STACKPOLE RPC2512 2512]  (hidden comment: RES 33 OHM 5% 1.5W 2512)
R43  value 33R  Power (Watts): 1.5W  [RES STACKPOLE RPC2512 2512]  (hidden comment: RES 33 OHM 5% 1.5W 2512)
R44  value 33R  Power (Watts): 1.5W  [RES STACKPOLE RPC2512 2512]  (hidden comment: RES 33 OHM 5% 1.5W 2512)
R45  Resistance: 3.3k  Power: 1/4W  [RES, 0603]  (hidden comment: RES 3.3K OHM 1% 1/4W 0603)
R46  Resistance: 3.3k  Power: 1/4W  [RES, 0603]  (hidden comment: RES 3.3K OHM 1% 1/4W 0603)
R47  Resistance: 3.3k  Power: 1/4W  [RES, 0603]  (hidden comment: RES 3.3K OHM 1% 1/4W 0603)
R48  Resistance: 3.3k  Power: 1/4W  [RES, 0603]  (hidden comment: RES 3.3K OHM 1% 1/4W 0603)
R49  Resistance: 3.3k  Power: 1/4W  [RES, 0603]  (hidden comment: RES 3.3K OHM 1% 1/4W 0603)
R50  Resistance: 3.3k  Power: 1/4W  [RES, 0603]  (hidden comment: RES 3.3K OHM 1% 1/4W 0603)

### Ports
AFE_BALANCE_CONTROL_[1..12] (in), FUSED_CELL_[0..12] (in)

### Nets
AFE_BALANCE_CONTROL_1: R50.1
AFE_BALANCE_CONTROL_2: R49.1
AFE_BALANCE_CONTROL_3: R48.1
AFE_BALANCE_CONTROL_4: R47.1
AFE_BALANCE_CONTROL_5: R46.1
AFE_BALANCE_CONTROL_6: R45.1
AFE_BALANCE_CONTROL_7: R32.1
AFE_BALANCE_CONTROL_8: R31.1
AFE_BALANCE_CONTROL_9: R30.1
AFE_BALANCE_CONTROL_10: R29.1
AFE_BALANCE_CONTROL_11: R28.1
AFE_BALANCE_CONTROL_12: R27.1
FUSED_CELL_0: R38.2 R44.2
FUSED_CELL_1: Q12.2(S) R37.2 R43.2
FUSED_CELL_2: Q11.2(S) R36.2 R42.2
FUSED_CELL_3: Q10.2(S) R35.2 R41.2
FUSED_CELL_4: Q9.2(S) R34.2 R40.2
FUSED_CELL_5: Q8.2(S) R33.2 R39.2
FUSED_CELL_6: Q7.2(S) R20.2 R26.2
FUSED_CELL_7: Q6.2(S) R19.2 R25.2
FUSED_CELL_8: Q5.2(S) R18.2 R24.2
FUSED_CELL_9: Q4.2(S) R17.2 R23.2
FUSED_CELL_10: Q3.2(S) R16.2 R22.2
FUSED_CELL_11: Q2.2(S) R15.2 R21.2
FUSED_CELL_12: Q1.2(S)
NetQ1_1: Q1.1(G) R27.2
NetQ1_3: Q1.3(D) R15.1 R21.1
NetQ2_1: Q2.1(G) R28.2
NetQ2_3: Q2.3(D) R16.1 R22.1
NetQ3_1: Q3.1(G) R29.2
NetQ3_3: Q3.3(D) R17.1 R23.1
NetQ4_1: Q4.1(G) R30.2
NetQ4_3: Q4.3(D) R18.1 R24.1
NetQ5_1: Q5.1(G) R31.2
NetQ5_3: Q5.3(D) R19.1 R25.1
NetQ6_1: Q6.1(G) R32.2
NetQ6_3: Q6.3(D) R20.1 R26.1
NetQ7_1: Q7.1(G) R45.2
NetQ7_3: Q7.3(D) R33.1 R39.1
NetQ8_1: Q8.1(G) R46.2
NetQ8_3: Q8.3(D) R34.1 R40.1
NetQ9_1: Q9.1(G) R47.2
NetQ9_3: Q9.3(D) R35.1 R41.1
NetQ10_1: Q10.1(G) R48.2
NetQ10_3: Q10.3(D) R36.1 R42.1
NetQ11_1: Q11.1(G) R49.2
NetQ11_3: Q11.3(D) R37.1 R43.1
NetQ12_1: Q12.1(G) R50.2
NetQ12_3: Q12.3(D) R38.1 R44.1

### Buses and harness runs
bus AFE_BALANCE_CONTROL_[1..12] = port AFE_BALANCE_CONTROL_[1..12]
bus FUSED_CELL_[0..12] = port FUSED_CELL_[0..12]

### Notes on the sheet
- Discharge Resistance: 16.5R
  Discharge Current @ 4.2V: 254.5 mA
  Discharge Power: 0.5 W/resistor
- PROJECT
- DOCUMENT
- DRAWN BY
- LAST MODIFIED
- PART NUMBER
- REVISION
- SHEET
- VARIANT
- OF
- Engineering 5 - 1002
  University of Waterloo
  (519) 888-4567 x32978
  hardware@uwmidsun.com

### Library data of the parts
Q1-Q12 = MOSFET P-CH 30V 3.8A SOT-23: P-Channel 30V 3.8A (Ta) 1.08W (Ta) Surface Mount SOT-23; Manufacturer: Diodes Incorporated; Drive Voltage (Max Rds On,  Min Rds On): 4.5V, 10V; Rds On (Max) @ Id, Vgs: 65 mOhm @ 3.8A, 10V; Vgs(th) (Max) @ Id: 2.1V @ 250µA; Vgs (Max): ±20V; Supplier 1: Digi-Key; RoHS: RoHS Compliant; Category: Discrete Semiconductor Products; Stock 1: 108364; Pricing 1: 1=0.59, 10=0.429, 100=0.2522, 500=0.14282, 1000=0.10949 (CAD); Packaging: Cut Tape (CT); Part Status: Active; FET Type: P-Channel; Technology: MOSFET (Metal Oxide); Current - Continuous Drain (Id) @ 25°C: 3.8A (Ta); FET Feature: -; Power Dissipation (Max): 1.08W (Ta); Operating Temperature: -55°C ~ 150°C (TJ); Mounting Type: Surface Mount; Supplier Device Package: SOT-23; Package / Case: TO-236-3, SC-59, SOT-23-3; ComponentLink1URL: https://www.diodes.com/assets/Datasheets/DMP3099L.pdf; ComponentLink1Description: https://www.diodes.com/assets/Datasheets/DMP3099L.pdf; Supplier Part Number 1: DMP3099L-7DICT-ND
R15-R26 R33-R44 = RES 33 OHM 5% 1.5W 2512: 33 Ohms ±5% 1.5W Chip Resistor 2512 (6432 Metric) Automotive AEC-Q200, Pulse Withstanding Thick Film; Manufacturer: Stackpole Electronics Inc.; Manufacturer Part Number: RPC2512JT33R0; Temperature Coefficient: ±100ppm/°C; Supplier 1: Digi-Key; RoHS: RoHS Compliant; Category: Resistors; Stock 1: 28556; Pricing 1: 1=0.88, 10=0.632, 100=0.3284, 1000=0.17685 (CAD); Packaging: Cut Tape (CT); Part Status: Active; Composition: Thick Film; Features: Automotive AEC-Q200, Pulse Withstanding; Operating Temperature: -55°C ~ 155°C; Package / Case: 2512 (6432 Metric); Supplier Device Package: 2512; Size / Dimension: 0.250" L x 0.122" W (6.35mm x 3.10mm); Height - Seated (Max): 0.026" (0.65mm); Failure Rate: -; ComponentLink1URL: https://www.seielect.com/Catalog/SEI-rpc.pdf; ComponentLink1Description: https://www.seielect.com/Catalog/SEI-rpc.pdf; Supplier Part Number 1: RPC2512JT33R0CT-ND; Tolerance: ±5%
R27-R32 R45-R50 = RES 3.3K OHM 1% 1/4W 0603: 3.3k Ohm ±1% 0.25W, 1/4W Chip Resistor 0603 (1608 Metric) Automotive AEC-Q200, Pulse Withstanding Thick Film; Manufacturer 1: Panasonic Electronic Components; Manufacturer Part Number 1: ERJ-PA3F3301V; Temperature Coefficient: ±100ppm/°C; Supplier 1: Digi-Key; Supplier Part Number 1: P3.3KBYCT-ND; Packaging: Cut Tape (CT); Part Status: Active; Composition: Thick Film; Operating Temperature: -55°C ~ 155°C; Package / Case: 0603 (1608 Metric); Supplier Device Package: 0603; Size / Dimension: 0.063" L x 0.031" W (1.60mm x 0.80mm); Height - Seated (Max): 0.022" (0.55mm); Failure Rate: -; ComponentLink1URL: https://industrial.panasonic.com/cdbs/www-data/pdf/RDO0000/AOA0000C291.pdf; ComponentLink1Description: https://industrial.panasonic.com/cdbs/www-data/pdf/RDO0000/AOA0000C291.pdf; Tolerance: ±1%

## Sheet BMS AFE - Cell Inputs.SchDoc: Title
size B; Organization: Midnight Sun Solar Rayce Car Team; Address1: University of Waterloo; Address2: 200 University Ave W; Address3: Waterloo, ON, Canada; Address4: N2L 3E9; DocumentNumber: 3; SheetNumber: 3; SheetTotal: 7; Website: www.uwmidsun.com; ProjectName: ProjectName
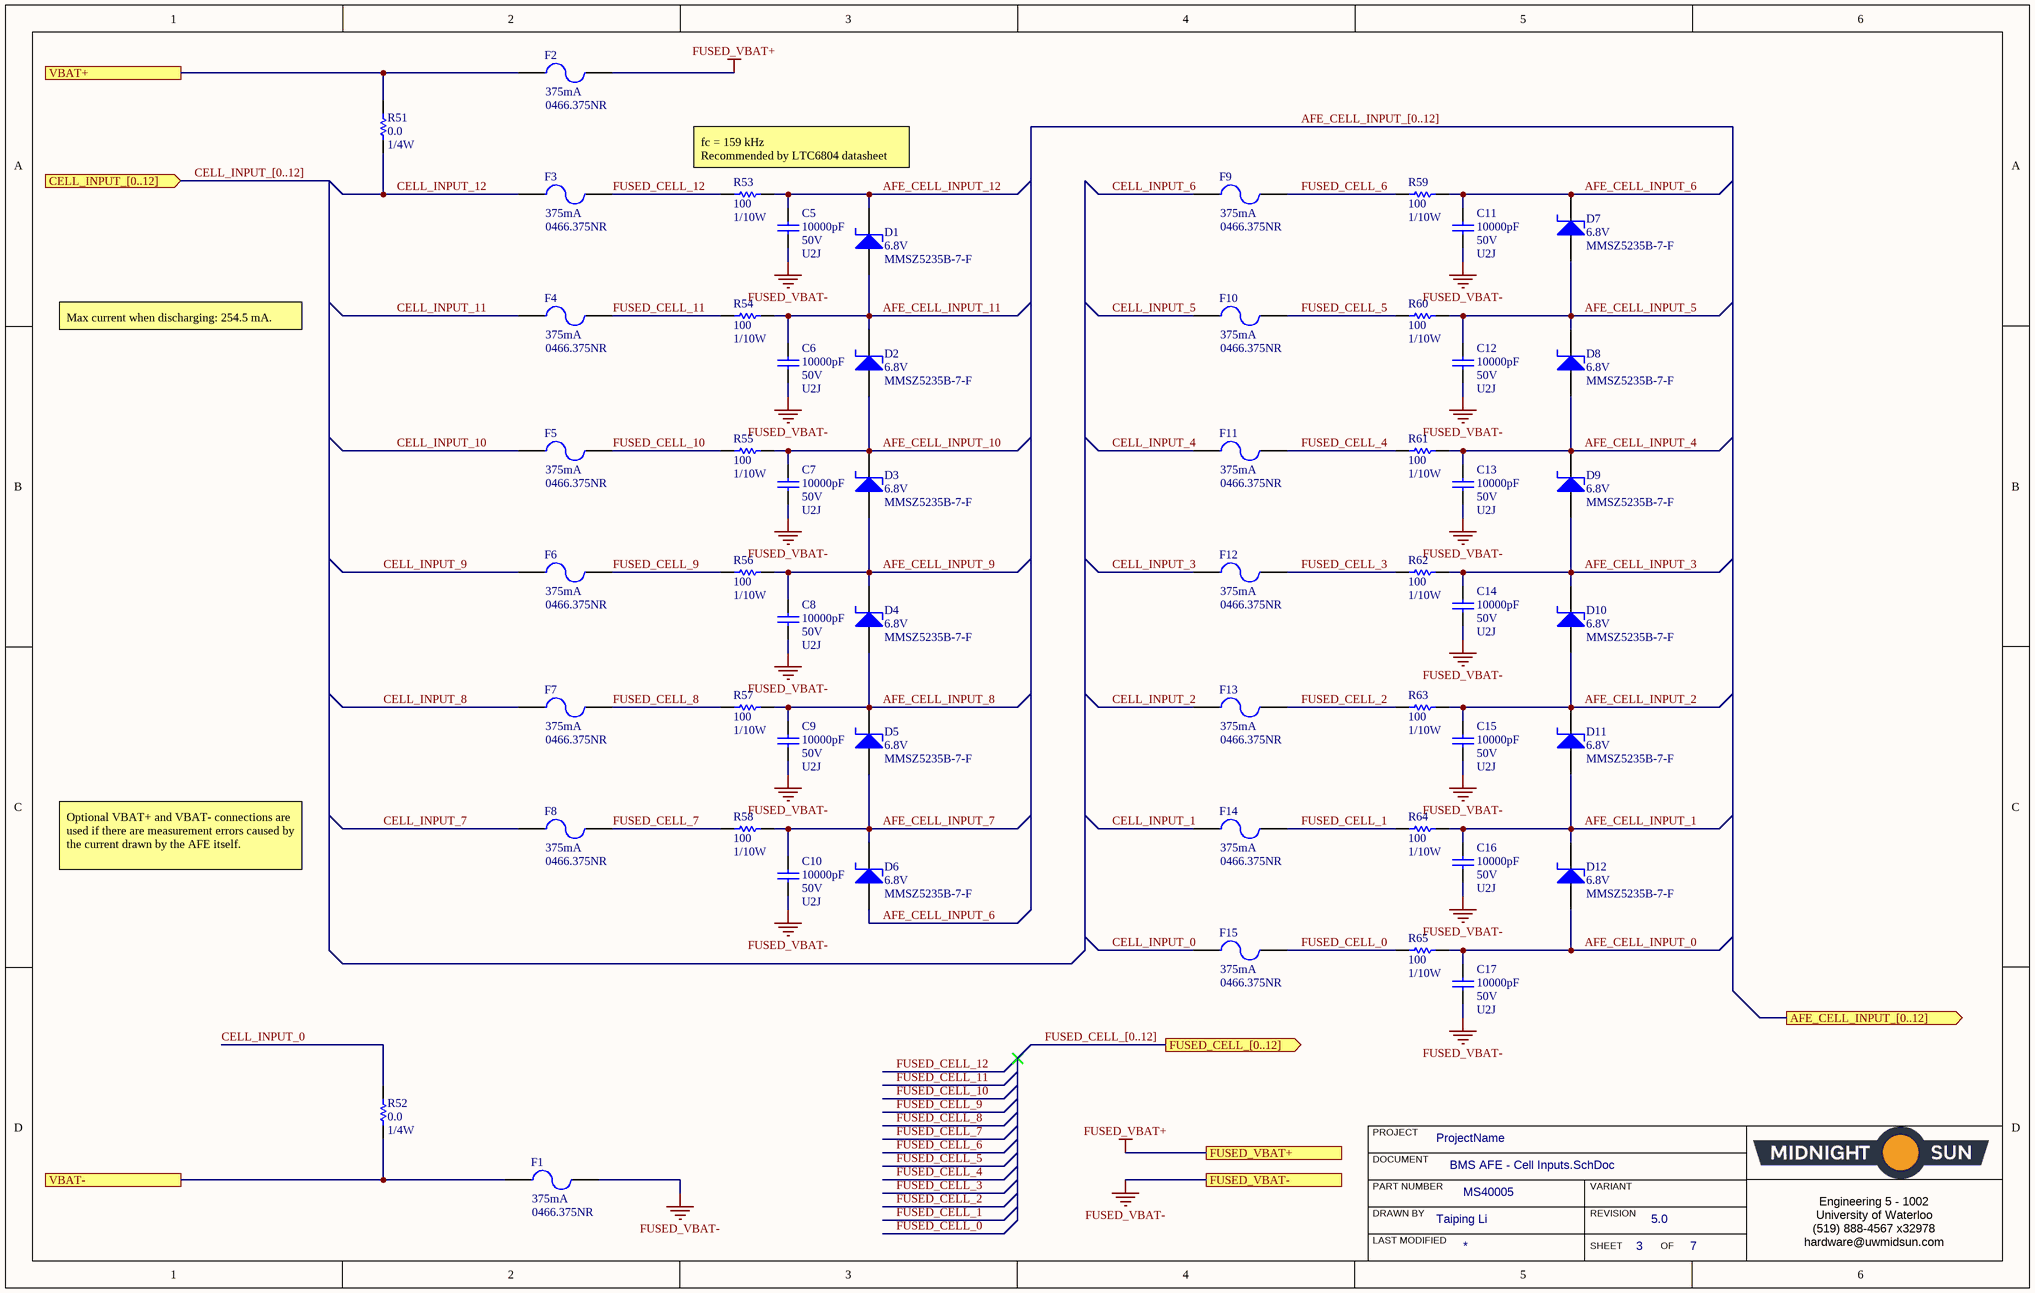
[diagram p3: BMS AFE - Cell Inputs.SchDoc]

### Parts
C5  Capacitance: 10000pF  Voltage: 50V  Temperature Coefficient: U2J  [CAP, 0603]  (hidden comment: CAP CER 10nF 50V 5% X7R 0603)
C6  Capacitance: 10000pF  Voltage: 50V  Temperature Coefficient: U2J  [CAP, 0603]  (hidden comment: CAP CER 10nF 50V 5% X7R 0603)
C7  Capacitance: 10000pF  Voltage: 50V  Temperature Coefficient: U2J  [CAP, 0603]  (hidden comment: CAP CER 10nF 50V 5% X7R 0603)
C8  Capacitance: 10000pF  Voltage: 50V  Temperature Coefficient: U2J  [CAP, 0603]  (hidden comment: CAP CER 10nF 50V 5% X7R 0603)
C9  Capacitance: 10000pF  Voltage: 50V  Temperature Coefficient: U2J  [CAP, 0603]  (hidden comment: CAP CER 10nF 50V 5% X7R 0603)
C10  Capacitance: 10000pF  Voltage: 50V  Temperature Coefficient: U2J  [CAP, 0603]  (hidden comment: CAP CER 10nF 50V 5% X7R 0603)
C11  Capacitance: 10000pF  Voltage: 50V  Temperature Coefficient: U2J  [CAP, 0603]  (hidden comment: CAP CER 10nF 50V 5% X7R 0603)
C12  Capacitance: 10000pF  Voltage: 50V  Temperature Coefficient: U2J  [CAP, 0603]  (hidden comment: CAP CER 10nF 50V 5% X7R 0603)
C13  Capacitance: 10000pF  Voltage: 50V  Temperature Coefficient: U2J  [CAP, 0603]  (hidden comment: CAP CER 10nF 50V 5% X7R 0603)
C14  Capacitance: 10000pF  Voltage: 50V  Temperature Coefficient: U2J  [CAP, 0603]  (hidden comment: CAP CER 10nF 50V 5% X7R 0603)
C15  Capacitance: 10000pF  Voltage: 50V  Temperature Coefficient: U2J  [CAP, 0603]  (hidden comment: CAP CER 10nF 50V 5% X7R 0603)
C16  Capacitance: 10000pF  Voltage: 50V  Temperature Coefficient: U2J  [CAP, 0603]  (hidden comment: CAP CER 10nF 50V 5% X7R 0603)
C17  Capacitance: 10000pF  Voltage: 50V  Temperature Coefficient: U2J  [CAP, 0603]  (hidden comment: CAP CER 10nF 50V 5% X7R 0603)
D1  6.8V  Manufacturer Part Number: MMSZ5235B-7-F  [DIODE SOD123]
D2  6.8V  Manufacturer Part Number: MMSZ5235B-7-F  [DIODE SOD123]
D3  6.8V  Manufacturer Part Number: MMSZ5235B-7-F  [DIODE SOD123]
D4  6.8V  Manufacturer Part Number: MMSZ5235B-7-F  [DIODE SOD123]
D5  6.8V  Manufacturer Part Number: MMSZ5235B-7-F  [DIODE SOD123]
D6  6.8V  Manufacturer Part Number: MMSZ5235B-7-F  [DIODE SOD123]
D7  6.8V  Manufacturer Part Number: MMSZ5235B-7-F  [DIODE SOD123]
D8  6.8V  Manufacturer Part Number: MMSZ5235B-7-F  [DIODE SOD123]
D9  6.8V  Manufacturer Part Number: MMSZ5235B-7-F  [DIODE SOD123]
D10  6.8V  Manufacturer Part Number: MMSZ5235B-7-F  [DIODE SOD123]
D11  6.8V  Manufacturer Part Number: MMSZ5235B-7-F  [DIODE SOD123]
D12  6.8V  Manufacturer Part Number: MMSZ5235B-7-F  [DIODE SOD123]
F1  Manufacturer Part Number: 0466.375NR  Current Rating: 375mA  [FUSE LITTLEFUSE 0466 1206]  (hidden comment: 375 mA)
F2  Manufacturer Part Number: 0466.375NR  Current Rating: 375mA  [FUSE LITTLEFUSE 0466 1206]  (hidden comment: 375 mA)
F3  Manufacturer Part Number: 0466.375NR  Current Rating: 375mA  [FUSE LITTLEFUSE 0466 1206]  (hidden comment: 375 mA)
F4  Manufacturer Part Number: 0466.375NR  Current Rating: 375mA  [FUSE LITTLEFUSE 0466 1206]  (hidden comment: 375 mA)
F5  Manufacturer Part Number: 0466.375NR  Current Rating: 375mA  [FUSE LITTLEFUSE 0466 1206]  (hidden comment: 375 mA)
F6  Manufacturer Part Number: 0466.375NR  Current Rating: 375mA  [FUSE LITTLEFUSE 0466 1206]  (hidden comment: 375 mA)
F7  Manufacturer Part Number: 0466.375NR  Current Rating: 375mA  [FUSE LITTLEFUSE 0466 1206]  (hidden comment: 375 mA)
F8  Manufacturer Part Number: 0466.375NR  Current Rating: 375mA  [FUSE LITTLEFUSE 0466 1206]  (hidden comment: 375 mA)
F9  Manufacturer Part Number: 0466.375NR  Current Rating: 375mA  [FUSE LITTLEFUSE 0466 1206]  (hidden comment: 375 mA)
F10  Manufacturer Part Number: 0466.375NR  Current Rating: 375mA  [FUSE LITTLEFUSE 0466 1206]  (hidden comment: 375 mA)
F11  Manufacturer Part Number: 0466.375NR  Current Rating: 375mA  [FUSE LITTLEFUSE 0466 1206]  (hidden comment: 375 mA)
F12  Manufacturer Part Number: 0466.375NR  Current Rating: 375mA  [FUSE LITTLEFUSE 0466 1206]  (hidden comment: 375 mA)
F13  Manufacturer Part Number: 0466.375NR  Current Rating: 375mA  [FUSE LITTLEFUSE 0466 1206]  (hidden comment: 375 mA)
F14  Manufacturer Part Number: 0466.375NR  Current Rating: 375mA  [FUSE LITTLEFUSE 0466 1206]  (hidden comment: 375 mA)
F15  Manufacturer Part Number: 0466.375NR  Current Rating: 375mA  [FUSE LITTLEFUSE 0466 1206]  (hidden comment: 375 mA)
R51  Resistance: 0.0  Power (Watts): 1/4W  [RES, 0603]  (hidden comment: RES 0.0 OHM 1/4W 0603)
R52  Resistance: 0.0  Power (Watts): 1/4W  [RES, 0603]  (hidden comment: RES 0.0 OHM 1/4W 0603)
R53  Resistance: 100  Power: 1/10W  [RES, 0603]  (hidden comment: RES 100 OHM 1% 1/10W 0603)
R54  Resistance: 100  Power: 1/10W  [RES, 0603]  (hidden comment: RES 100 OHM 1% 1/10W 0603)
R55  Resistance: 100  Power: 1/10W  [RES, 0603]  (hidden comment: RES 100 OHM 1% 1/10W 0603)
R56  Resistance: 100  Power: 1/10W  [RES, 0603]  (hidden comment: RES 100 OHM 1% 1/10W 0603)
R57  Resistance: 100  Power: 1/10W  [RES, 0603]  (hidden comment: RES 100 OHM 1% 1/10W 0603)
R58  Resistance: 100  Power: 1/10W  [RES, 0603]  (hidden comment: RES 100 OHM 1% 1/10W 0603)
R59  Resistance: 100  Power: 1/10W  [RES, 0603]  (hidden comment: RES 100 OHM 1% 1/10W 0603)
R60  Resistance: 100  Power: 1/10W  [RES, 0603]  (hidden comment: RES 100 OHM 1% 1/10W 0603)
R61  Resistance: 100  Power: 1/10W  [RES, 0603]  (hidden comment: RES 100 OHM 1% 1/10W 0603)
R62  Resistance: 100  Power: 1/10W  [RES, 0603]  (hidden comment: RES 100 OHM 1% 1/10W 0603)
R63  Resistance: 100  Power: 1/10W  [RES, 0603]  (hidden comment: RES 100 OHM 1% 1/10W 0603)
R64  Resistance: 100  Power: 1/10W  [RES, 0603]  (hidden comment: RES 100 OHM 1% 1/10W 0603)
R65  Resistance: 100  Power: 1/10W  [RES, 0603]  (hidden comment: RES 100 OHM 1% 1/10W 0603)

### Ports
AFE_CELL_INPUT_[0..12] (out), CELL_INPUT_[0..12] (in), FUSED_CELL_[0..12] (out), FUSED_VBAT+, FUSED_VBAT-, VBAT+, VBAT-

### Nets
FUSED_VBAT+: F2.2 ; port FUSED_VBAT+
FUSED_VBAT-: C5.2 C6.2 C7.2 C8.2 C9.2 C10.2 C11.2 C12.2 C13.2 C14.2 C15.2 C16.2 C17.2 F1.2 ; port FUSED_VBAT-
AFE_CELL_INPUT_0: C17.1 D12.2(A) R65.2
AFE_CELL_INPUT_1: C16.1 D11.2(A) D12.1(K) R64.2
AFE_CELL_INPUT_2: C15.1 D10.2(A) D11.1(K) R63.2
AFE_CELL_INPUT_3: C14.1 D9.2(A) D10.1(K) R62.2
AFE_CELL_INPUT_4: C13.1 D8.2(A) D9.1(K) R61.2
AFE_CELL_INPUT_5: C12.1 D7.2(A) D8.1(K) R60.2
AFE_CELL_INPUT_6: C11.1 D6.2(A) D7.1(K) R59.2
AFE_CELL_INPUT_7: C10.1 D5.2(A) D6.1(K) R58.2
AFE_CELL_INPUT_8: C9.1 D4.2(A) D5.1(K) R57.2
AFE_CELL_INPUT_9: C8.1 D3.2(A) D4.1(K) R56.2
AFE_CELL_INPUT_10: C7.1 D2.2(A) D3.1(K) R55.2
AFE_CELL_INPUT_11: C6.1 D1.2(A) D2.1(K) R54.2
AFE_CELL_INPUT_12: C5.1 D1.1(K) R53.2
CELL_INPUT_0: F15.1 R52.1
CELL_INPUT_1: F14.1
CELL_INPUT_2: F13.1
CELL_INPUT_3: F12.1
CELL_INPUT_4: F11.1
CELL_INPUT_5: F10.1
CELL_INPUT_6: F9.1
CELL_INPUT_7: F8.1
CELL_INPUT_8: F7.1
CELL_INPUT_9: F6.1
CELL_INPUT_10: F5.1
CELL_INPUT_11: F4.1
CELL_INPUT_12: F3.1 R51.2
FUSED_CELL_0: F15.2 R65.1
FUSED_CELL_1: F14.2 R64.1
FUSED_CELL_2: F13.2 R63.1
FUSED_CELL_3: F12.2 R62.1
FUSED_CELL_4: F11.2 R61.1
FUSED_CELL_5: F10.2 R60.1
FUSED_CELL_6: F9.2 R59.1
FUSED_CELL_7: F8.2 R58.1
FUSED_CELL_8: F7.2 R57.1
FUSED_CELL_9: F6.2 R56.1
FUSED_CELL_10: F5.2 R55.1
FUSED_CELL_11: F4.2 R54.1
FUSED_CELL_12: F3.2 R53.1
NetF1_1: F1.1 R52.2 ; port VBAT-
NetF2_1: F2.1 R51.1 ; port VBAT+

### Buses and harness runs
bus AFE_CELL_INPUT_[0..12] = port AFE_CELL_INPUT_[0..12]
bus CELL_INPUT_[0..12] = port CELL_INPUT_[0..12]
bus FUSED_CELL_[0..12] = port FUSED_CELL_[0..12]

### Notes on the sheet
- (near R53) fc = 159 kHz
  Recommended by LTC6804 datasheet
- Max current when discharging: 254.5 mA.
- Optional VBAT+ and VBAT- connections are used if there are measurement errors caused by the current drawn by the AFE itself.
- PROJECT
- DOCUMENT
- DRAWN BY
- LAST MODIFIED
- PART NUMBER
- REVISION
- SHEET
- VARIANT
- OF
- Engineering 5 - 1002
  University of Waterloo
  (519) 888-4567 x32978
  hardware@uwmidsun.com

### Library data of the parts
C5-C17 = CAP CER 10nF 50V 5% X7R 0603: 10000pF ±5% 50V Ceramic Capacitor U2J 0603 (1608 Metric); Manufacturer 1: KEMET; Manufacturer Part Number 1: C0603C103J5JAC7867; Supplier 1: Digi-Key; Supplier Part Number 1: 399-13384-1-ND; Packaging: Cut Tape (CT); Part Status: Active; Operating Temperature: -55°C ~ 125°C; Ratings: -; Failure Rate: -; Mounting Type: Surface Mount, MLCC; Package / Case: 0603 (1608 Metric); Size / Dimension: 0.063" L x 0.032" W (1.60mm x 0.80mm); Height - Seated (Max): -; Thickness (Max): 0.034" (0.87mm); Lead Spacing: -; Lead Style: -; ComponentLink1URL: http://www.kemet.com/docfinder?Partnumber=C0603C103J5JAC7867; ComponentLink1Description: http://www.kemet.com/docfinder?Partnumber=C0603C103J5JAC7867; Tolerance: ±5%
D1-D12 = DIODE ZENER 6.8V 500MW SOD123: Zener Diode 6.8V 500mW ±5% Surface Mount SOD-123; Manufacturer: Diodes Incorporated; Supplier 1: Digi-Key; RoHS: RoHS Compliant; Category: Discrete Semiconductor Products; Stock 1: 24231; Pricing 1: 1=0.35, 10=0.286, 100=0.1513, 500=0.09956, 1000=0.06769 (CAD); Packaging: Cut Tape (CT); Part Status: Active; Tolerance: ±5%; Operating Temperature: -65°C ~ 150°C; Mounting Type: Surface Mount; Package / Case: SOD-123; Supplier Device Package: SOD-123; Base Part Number: MMSZ5235B; ComponentLink1URL: https://www.diodes.com/assets/Datasheets/ds18010.pdf; ComponentLink1Description: https://www.diodes.com/assets/Datasheets/ds18010.pdf; Supplier Part Number 1: MMSZ5235B-FDICT-ND
F1-F15 = FUSE 375MA 125VDC 1206: FUSE BOARD MNT 375MA 125VAC/VDC; Manufacturer: Littelfuse; Body Material: Thermoplastic; Voltage Rating (DC): 125V; Resistance: 690mR; DC Cold Resistance: 350mR; Fuse Type: Board Mount (Cartridge Style Excluded); Approvals: CSA,UL; Supplier 1: Digi-Key; Stock 1: 22359; Pricing 1: 1=0.84, 5=0.812, 10=0.787, 50=0.6618, 100=0.5493, 250=0.4994, 500=0.4245, 1000=0.37455 (USD); Mount: Surface Mount; Case/Package: 1206; Number of Pins: 2; Case Code (Metric): 3216; Case Code (Imperial): 1206; Housing Material: Ceramic; Terminal Material: Copper; Min Operating Temperature: -55°C; Max Operating Temperature: 90°C; Packaging: Tape and Reel; Package Quantity: 5000; Voltage Rating: 125V; Termination: SMD/SMT; Voltage Rating (AC): 125V; Fuse Current: 375mA; Working Voltage: 125V; Length: 3.18mm; Height: 0.023inch; Width: 0.06inch; Depth: 1.52mm; Radiation Hardening: No; REACH SVHC: Unknown; Lead Free: Lead Free; ComponentLink1URL: http://www.littelfuse.com/data/en/Data_Sheets/Littelfuse_Fuse_466.pdf; ComponentLink1Description: http://www.littelfuse.com/data/en/Data_Sheets/Littelfuse_Fuse_466.pdf; ComponentLink2URL: http://www.littelfuse.com/~/media/electronics/datasheets/fuses/littelfuse_fuse_466_datasheet.pdf.pdf; ComponentLink2Description: http://www.littelfuse.com/~/media/electronics/datasheets/fuses/littelfuse_fuse_466_datasheet.pdf.pdf; ComponentLink3URL: //media.digikey.com/pdf/Data%20Sheets/Littelfuse%20PDFs/466%20Series%20Drawing.pdf; ComponentLink3Description: //media.digikey.com/pdf/Data%20Sheets/Littelfuse%20PDFs/466%20Series%20Drawing.pdf; ComponentLink4URL: http://www.farnell.com/datasheets/48294.pdf; ComponentLink4Description: http://www.farnell.com/datasheets/48294.pdf; ComponentLink5URL: https://www.verical.com/server-webapp/html/getDatasheet?partID=134212; ComponentLink5Description: https://www.verical.com/server-webapp/html/getDatasheet?partID=134212; Supplier Part Number 1: F1453CT-ND
R51 R52 = RES 0.0 OHM 1/4W 0603: as R9 on sheet BMS AFE - AFE; Supplier 1: Digi-Key; Supplier Part Number 1: 541-0.0SBCT-ND; Packaging: Cut Tape (CT); Part Status: Active; Composition: Thick Film; Operating Temperature: -55°C ~ 155°C; Package / Case: 0603 (1608 Metric); Supplier Device Package: 0603; Size / Dimension: 0.063" L x 0.033" W (1.60mm x 0.85mm); Height - Seated (Max): 0.022" (0.55mm); Failure Rate: -; ComponentLink1URL: http://www.vishay.com/docs/20043/crcwhpe3.pdf; ComponentLink1Description: http://www.vishay.com/docs/20043/crcwhpe3.pdf
R53-R65 = RES 100 OHM 1% 1/10W 0603: as R7 on sheet BMS AFE - AFE; Supplier 1: Digi-Key; Supplier Part Number 1: 311-100HRCT-ND; Packaging: Cut Tape (CT); Part Status: Active; Composition: Thick Film; Operating Temperature: -55°C ~ 155°C; Package / Case: 0603 (1608 Metric); Supplier Device Package: 0603; Size / Dimension: 0.063" L x 0.031" W (1.60mm x 0.80mm); Height - Seated (Max): 0.022" (0.55mm); Failure Rate: -; ComponentLink1URL: http://www.yageo.com/documents/recent/PYu-RC_Group_51_RoHS_L_7.pdf; ComponentLink1Description: http://www.yageo.com/documents/recent/PYu-RC_Group_51_RoHS_L_7.pdf; Tolerance: ±1%